# EAGLE design powersupply_example (EAGLE 7.4.0)
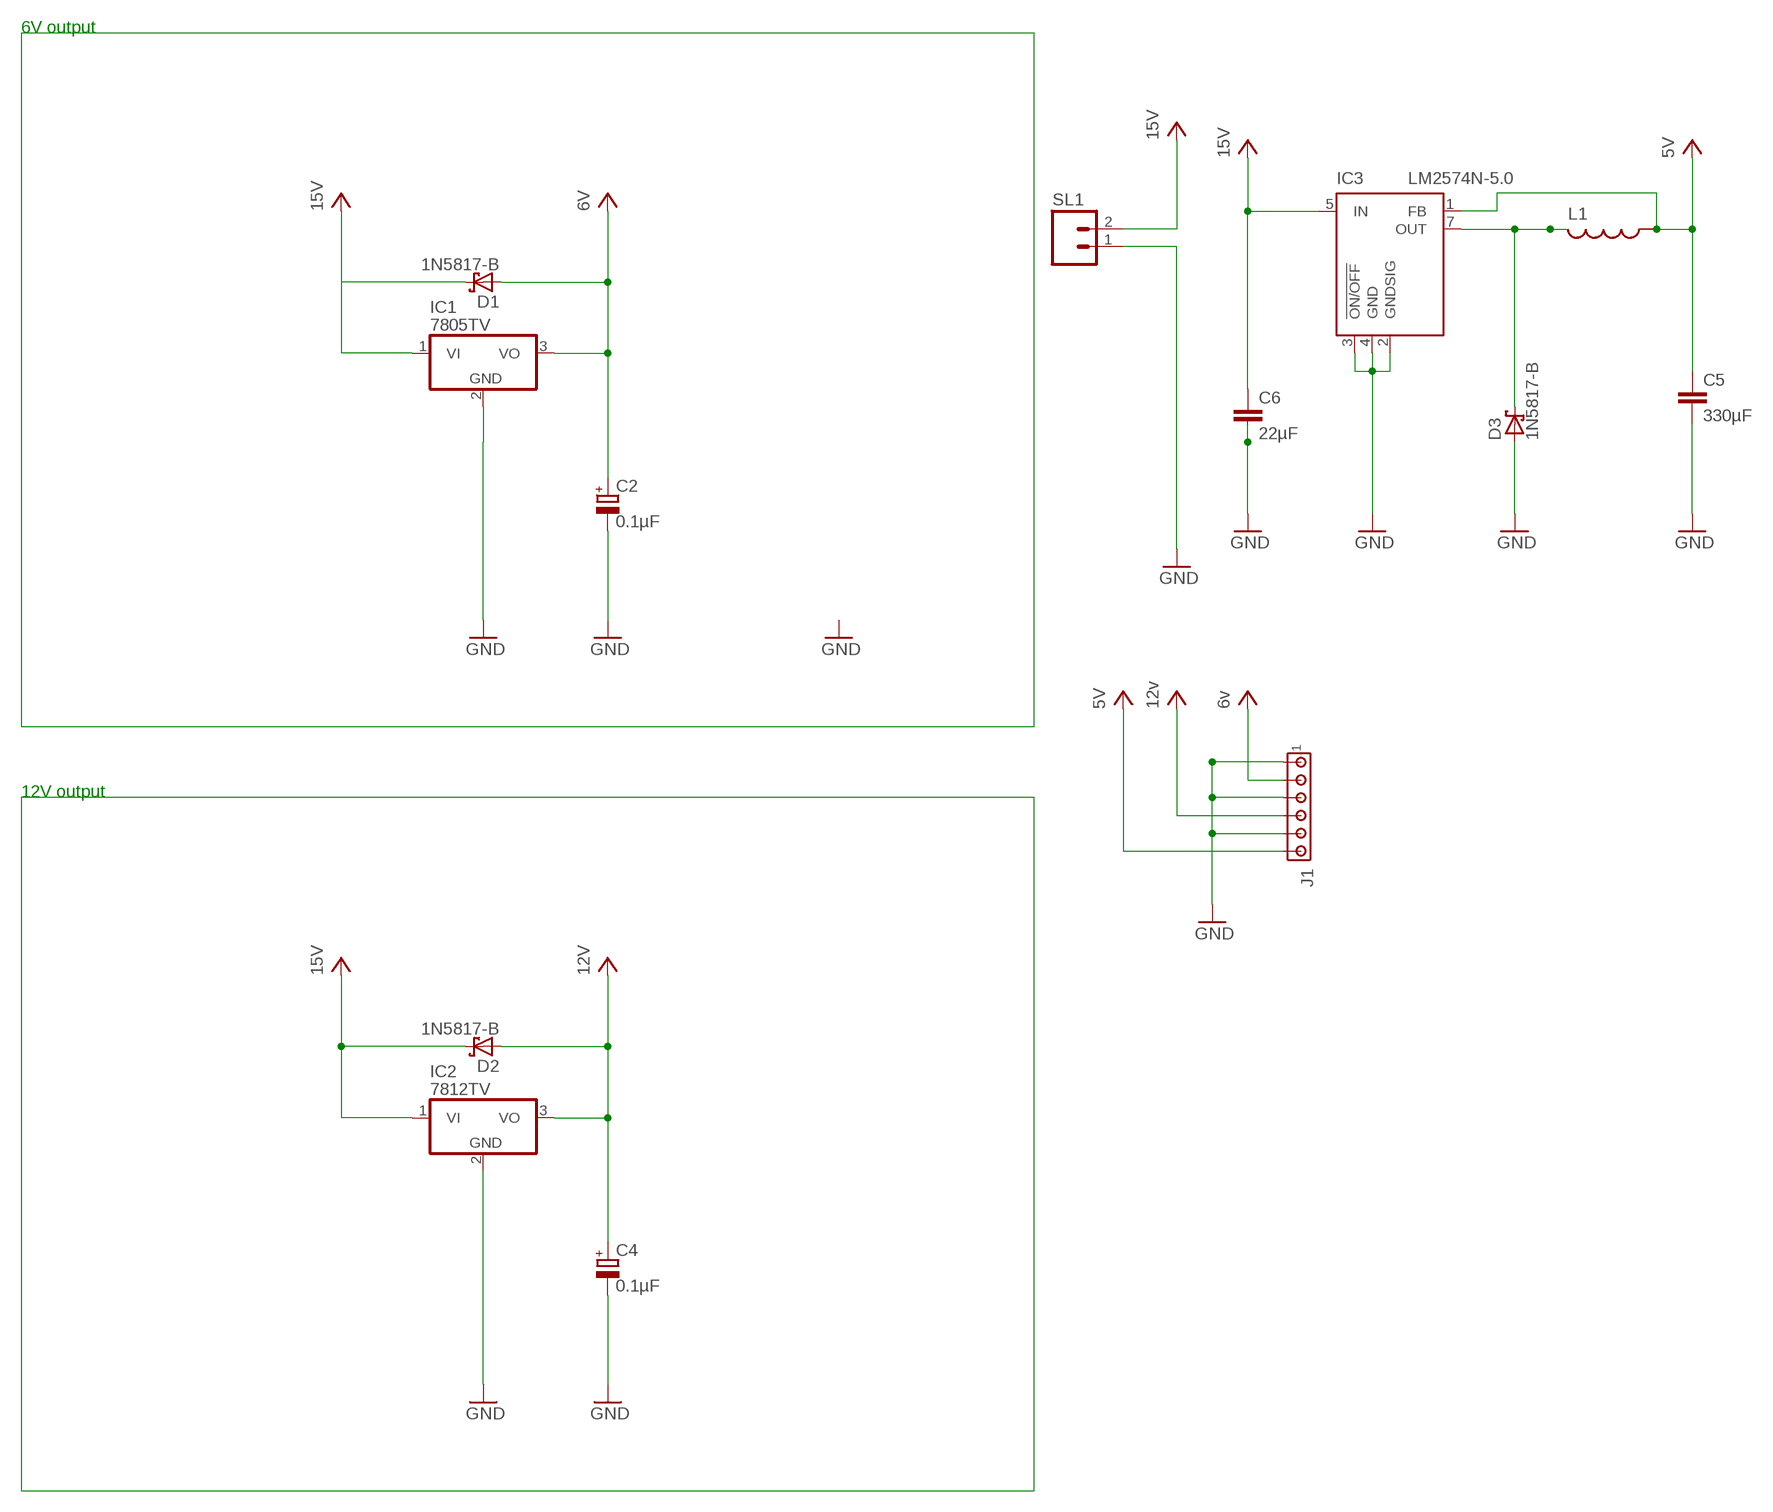
[diagram p0: schematic, sheet 1]

## Parts
C2  0.1µF  CPOL-EUE2.5-5  [E2,5-5]
C4  0.1µF  CPOL-EUE2.5-5  [E2,5-5]
C5  330µF  C-EU025-040X050  [C025-040X050]
C6  22µF  C-EU025-040X050  [C025-040X050]
D1  1N5817-B  [DO41-7.6]
D2  1N5817-B  [DO41-7.6]
D3  1N5817-B  [DO41-7.6]
IC1  7805TV  [TO220V]
IC2  7812TV  [TO220V]
IC3  LM2574N-5.0  [DIL08]
J1  MTA06-100  [10X06MTA]
L1  L-US0204/7  [0204/7]
SL1  M02  [02P]

## Nets
5V: C5.1 IC3.1(FB) J1.6 L1.1
6V: C2.+ D1.A IC1.3(VO) J1.2 ; supply symbol labelled 6v
12V: C4.+ D2.A IC2.3(VO) J1.4 ; supply symbol labelled 12v
15V: C6.1 D1.C D2.C IC1.1(VI) IC2.1(VI) IC3.5(IN) SL1.2
GND: C2.- C4.- C5.2 C6.2 D3.A IC1.2(GND) IC2.2(GND) IC3.2(GNDSIG) IC3.3(!ON/OFF) IC3.4(GND) J1.1 J1.3 J1.5 SL1.1
N$4: D3.C IC3.7(OUT) L1.2

## Notes on the sheet
- 6V output
- 12V output

## Library data of the parts
C2 C4 = rcl:CPOL-EU: POLARIZED CAPACITOR, European symbol
C5 C6 = rcl:C-EU: CAPACITOR, European symbol
D1-D3 = diode:1N581*: 1.0A SCHOTTKY BARRIER RECTIFIER Source: http://www.diodes.com/datasheets/ds23001.pdf
IC1 IC2 = linear:78*: Positive VOLTAGE REGULATOR Source: http://cache.national.com/ds/LM/LM78L05.pdf http://www.fairchildsemi.com/ds/LM/LM7805.pdf
IC3 = linear:LM2574?-*: SIMPLE SWITCHER 0.5A Step-Down Voltage Regulator Source: http://cache.national.com/ds/LM/LM2574.pdf
J1 = con-amp:MTA06-100: AMP connector Connection corrected 2014-09-19
L1 = resistor:L-US: INDUCTOR, American symbol
SL1 = con-amp-quick:M02: AMP QUICK CONNECTOR; OC_FARNELL: unknown; OC_NEWARK: unknown

## Net classes
0 default: width 0.61 mm, clearance 0.254 mm
1 ground: width 0.61 mm, clearance 0.254 mm

## Board
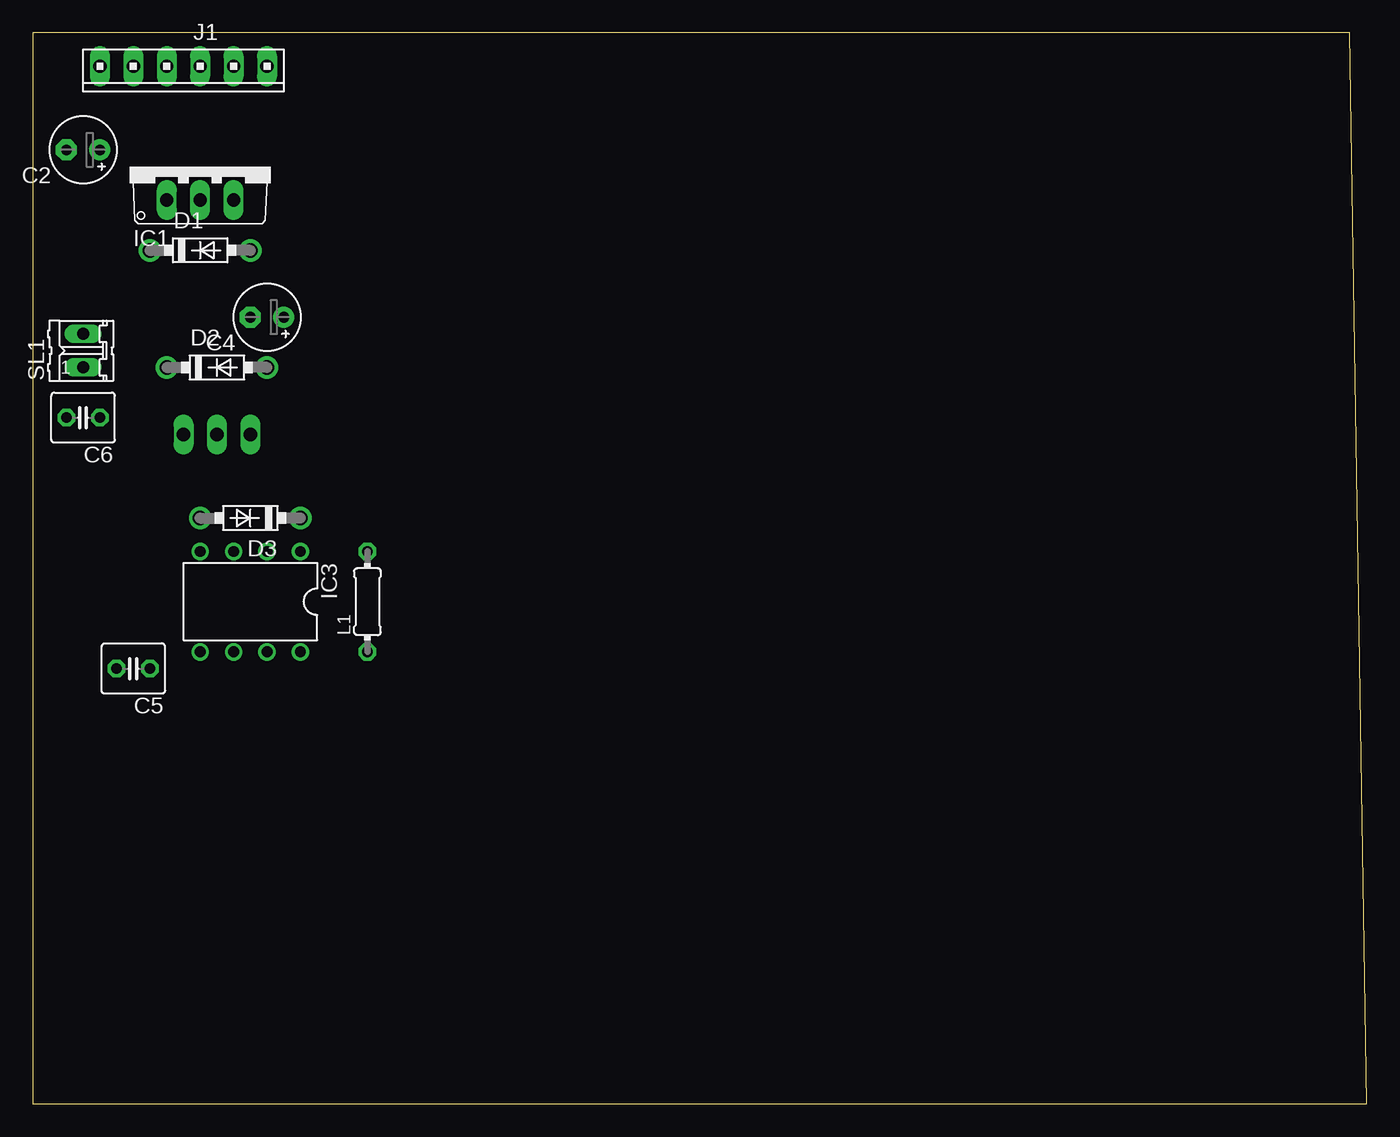
[diagram p1: board, top side]
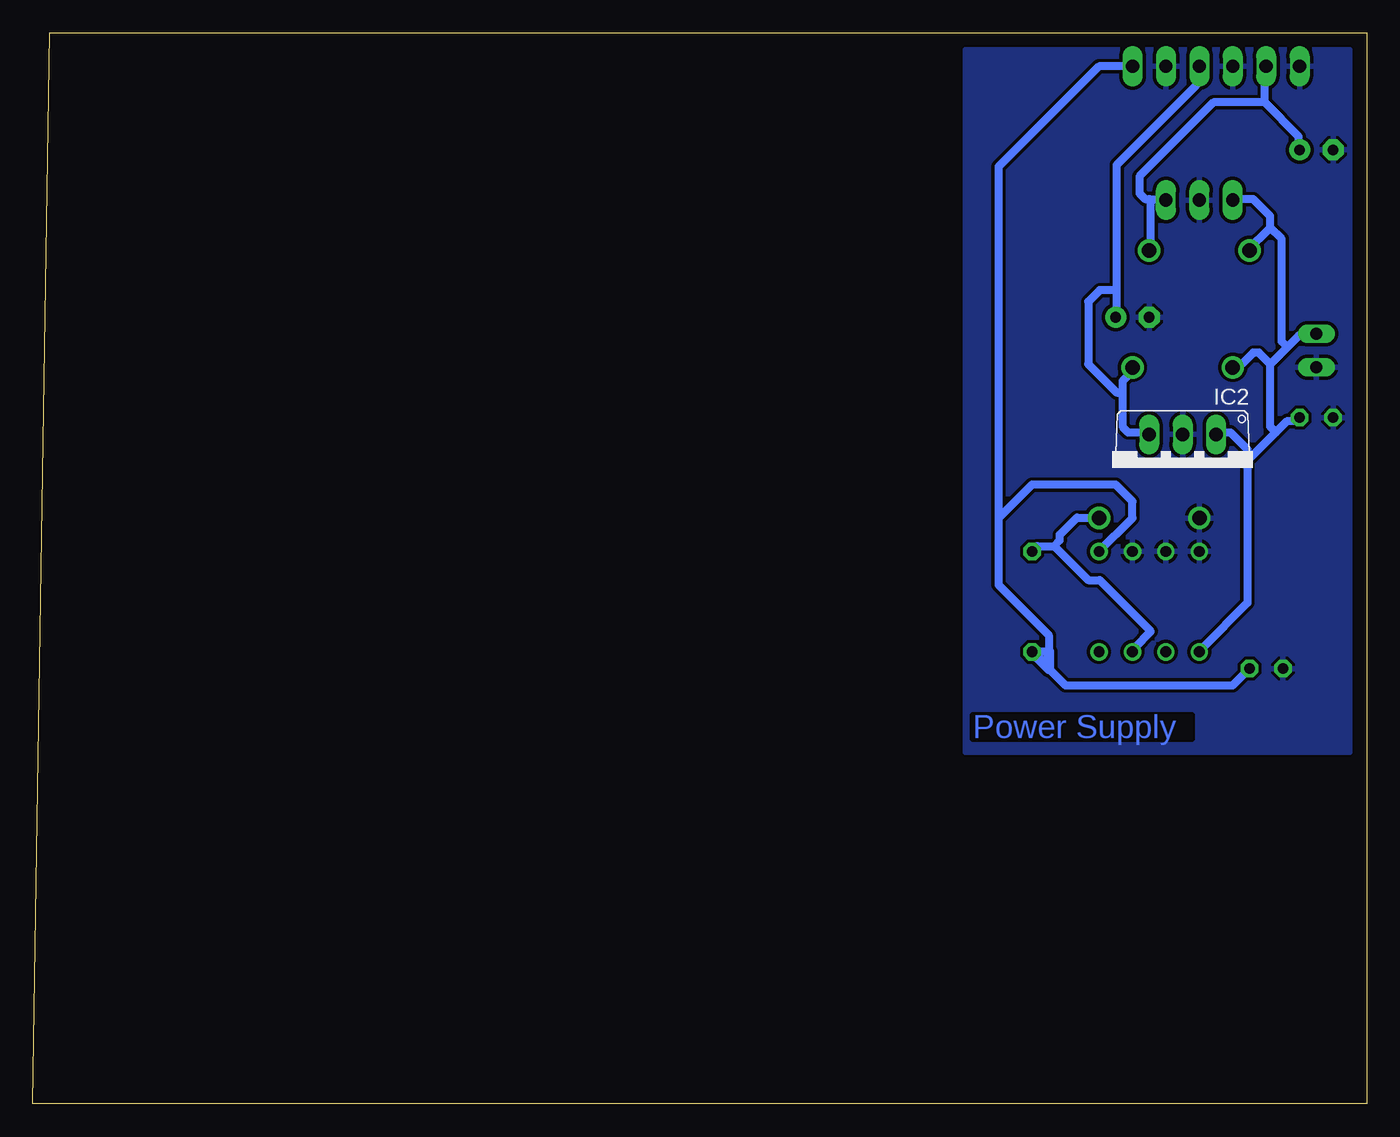
[diagram p2: board, bottom side, seen from below]

Size 101.27 x 81.27 mm. Coordinates in mm from the lower left corner, seen from the top.
Outline: 0,0 101.27,0 100,81.27 0,81.27 0,0
Copper layers (1*16): Top 0.035mm / dielectric 1.5mm / Bottom 0.035mm
Design rules "default": minimum track width 10mil, minimum drill 24mil, track to track 8mil, track to pad 8mil, pad to pad 8mil, via to via 8mil, smd to smd 8mil, copper to edge 40mil, drill to drill 8mil, minimum pad ring 10mil, minimum via ring 8mil, stop-mask expansion 4mil, vias tented up to drill 0mil, thermal gap 10mil

### Footprints (pad centres in the part's own frame; a part is rotated, then mirrored left to right if it is on the bottom)
E2,5-5 = drill 0.813 pad 1.6: + -1.27,0 | drill 0.813 pad 1.6 octagon: - 1.27,0
C025-040X050 = drill 0.813 octagon: 1 -1.27,0; 2 1.27,0
DO41-7.6 = drill 1.1 pad 1.7: A 3.81,0; C -3.81,0
TO220V = drill 1.016 long: 1 -2.54,-2.54; 2 0,-2.54; 3 2.54,-2.54
DIL08 = drill 0.813 pad 1.27: 1 -3.81,-3.81; 2 -1.27,-3.81; 3 1.27,-3.81; 4 3.81,-3.81; 5 3.81,3.81; 6 1.27,3.81; 7 -1.27,3.81; 8 -3.81,3.81
10X06MTA = drill 1.016 long: 1 6.35,0; 2 3.81,0; 3 1.27,0; 4 -1.27,0; 5 -3.81,0; 6 -6.35,0
0204/7 = drill 0.813 octagon: 1 -3.81,0; 2 3.81,0
02P = drill 0.914 long: 1 -1.27,0; 2 1.27,0

### Placement (x,y rotation side)
C2  3.81,72.39 180 top
C4  17.78,59.69 180 top
C5  7.62,33.02 180 top
C6  3.81,52.07 180 top
D1  12.7,64.77 0 top
D2  13.97,55.88 0 top
D3  16.51,44.45 180 top
IC1  12.7,71.12 0 top
IC2  13.97,48.26 180 bottom
IC3  16.51,38.1 180 top
J1  11.43,78.74 180 top
L1  25.4,38.1 90 top
SL1  3.81,57.15 90 top

### Tracks (layer width: path | path; a pad name or v marks a point on that pad's centre or on a via)
5V
  Bottom 0.61: J1.6 20.32,78.74 27.94,71.12 27.94,44.45 | 27.94,44.45 27.94,39.37 24.13,35.56 24.13,34.29 L1.1 | 24.13,33.02 22.86,31.75 10.16,31.75 C5.1 | IC3.1 17.78,44.45 17.78,45.72 19.05,46.99 25.4,46.99 27.94,44.45
  Bottom 0.813: L1.1 24.13,33.02 24.13,34.29
6V
  Bottom 0.61: 16.51,68.66 16.82,68.66 17.25,69.09 17.25,70.38 11.63,76 7.75,76 | 16.51,68.66 15.52,68.66 IC1.3 | D1.A 16.38,64.77 16.38,68.53 16.51,68.66 | 7.75,76 7.75,78.59 J1.2 | 7.75,76 5.16,73.41 5.16,72.54 C2.+
12V
  Bottom 0.61: 18.54,53.98 18.54,54.84 17.68,55.7 D2.A | 18.54,53.98 18.54,51.38 18.11,50.95 16.82,50.95 IC2.3 | 18.97,61.75 18.97,60.02 C4.+ | 18.97,61.75 18.97,71.25 12.93,77.29 12.93,78.59 J1.4 | 18.54,53.98 18.97,53.98 21.13,56.13 21.13,60.88 20.27,61.75 18.97,61.75
15V
  Bottom 0.61: 7.31,66.5 7.31,67.36 8.61,68.66 9.91,68.66 IC1.1 | 7.31,66.5 9.04,64.77 D1.C | 9.04,48.79 9.04,49.66 10.34,50.95 11.2,50.95 IC2.1 | 9.04,48.79 9.04,38 12.5,34.54 IC3.5 | 9.04,48.79 6.88,50.95 | 6.88,50.95 6.02,51.82 5.16,51.82 C6.1 | 7.31,56.13 6.02,57.43 | 6.02,57.43 5.16,58.29 3.86,58.29 SL1.2 | 7.31,56.13 7.31,51.38 6.88,50.95 | 7.31,56.13 8.18,57 8.61,57 9.47,56.13 9.91,56.13 D2.C | 7.31,66.5 6.45,65.63 6.45,57.86 6.02,57.43
GND
  pour Bottom: 1.27,80.01 30.48,80.01 30.48,26.67 1.27,26.67
N$4
  Bottom 0.61: 23.72,42.32 21.13,39.73 20.27,39.73 16.38,35.84 17.68,34.54 IC3.7 | 23.72,42.32 25.02,42.32 L1.2 | 23.72,42.32 23.29,42.75 23.29,43.18 22,44.48 20.7,44.48 D3.C

### Text on the board
Bottom: Power Supply